# EasyEDA schematic FAN__Digital_Dimmer.json
TITLE: Sheet_1; REV: 1.0; Date: 2024-11-26; Sheet: 1/1; Drawn By: AmirB; Company: Your Company
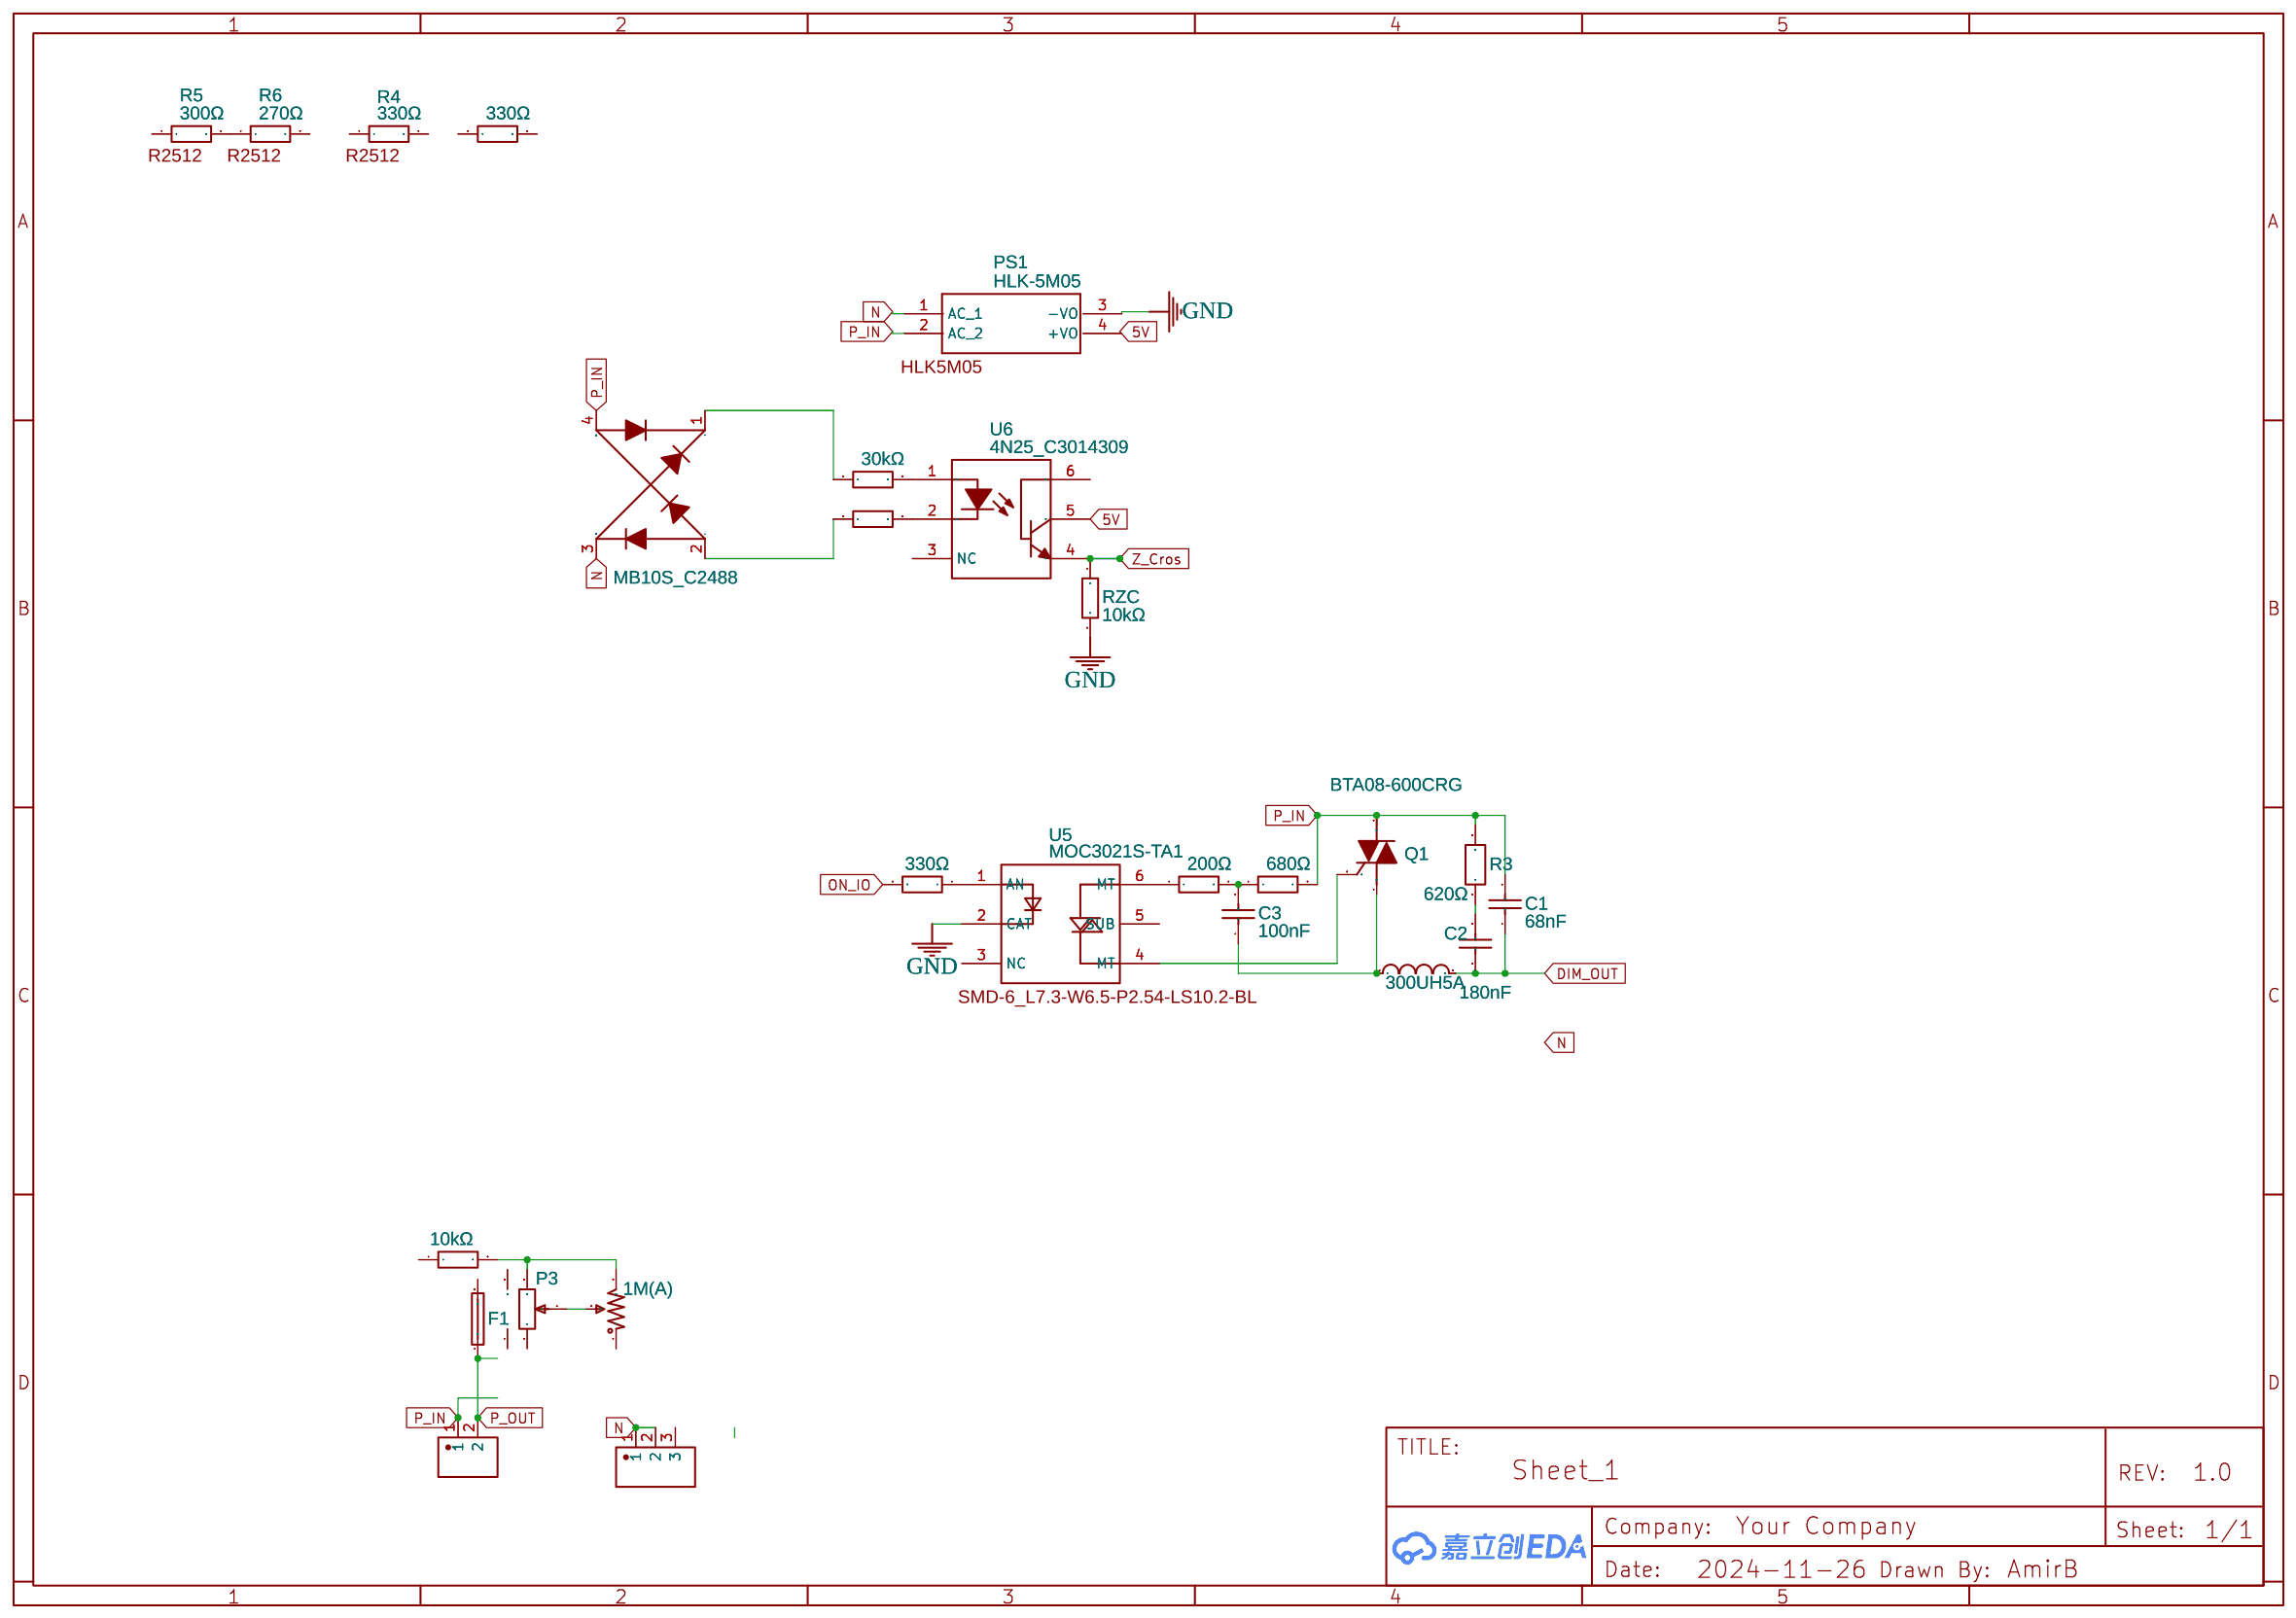
[diagram p0: schematic sheet]

## Parts
C1  68nF  [CAP-TH_L13.0-W6.0-P10.00-D1.2]
C2  180nF  [CAP-TH_L13.0-W6.0-P10.00-D1.2]
C3  100nF  [CAP-TH_L13.0-W6.0-P10.00-D0.6]
D1  MB10S_C2488  [MBS_L4.7-W3.8-P2.40-LS7.0-TL]
F1  0215002.MXEP  [FUSE-TH_BD5.5-L21.5-P25.50-D0.7]
P3  长柄旋转电位器  [RES-ADJ-TH_RV09]
P7  1M(A)  [RES-ADJ-TH_3P-L10.0-W10.0-P2.50-L]
PS1  HLK-5M05  [HLK5M05]
Q1  BTA08-600CRG  [TO-220-3_L10.0-W4.5-P2.54-L]
R1  30kΩ  [R2512]
R2  30kΩ  [R2512]
R3  620Ω  [R2512]
R4  330Ω  [R2512]
R5  300Ω  [R2512]
R6  270Ω  [R2512]
R7  330Ω  [R2512]
R8  200Ω  [R2512]
R9  680Ω  [R2512]
R14  330Ω  [R0603]
RL1V  10kΩ  [R0603]
RZC  10kΩ  [R0603]
U1  KF301R-5.0-3P  [CONN-TH_3P-P5.00_KF301R-5.0-3P]
U2  KF301-5.0-2P  [CONN-TH_P5.00_KF301-5.0-2P]
U3  300UH5A  [IND-TH_BD26.0-P10.80_300UH5A]
U5  MOC3021S-TA1  [SMD-6_L7.3-W6.5-P2.54-LS10.2-BL]
U6  4N25_C3014309  [DIP-6_L7.3-W6.5-P2.54-LS7.6-BL]

## Library data of the parts
C1 = MPP683J4130509LC: Supplier: LCSC; Manufacturer: SRD(圣融达); Supplier Part: C93252; JLCPCB Part Class: Extended Part; Package Display: No
C2 = MPP184J4130610LC: Supplier: LCSC; Manufacturer: SRD(圣融达); Supplier Part: C109611; JLCPCB Part Class: Extended Part; Package Display: No
C3 = MP2104KGC3RLC: Supplier: LCSC; Manufacturer: SRD(圣融达); Supplier Part: C93370; JLCPCB Part Class: Extended Part; Package Display: No
D1 = MB10S_C2488: Supplier: LCSC; Manufacturer: MDD(辰达半导体); Supplier Part: C2488; JLCPCB Part Class: Basic Part; Package Display: No
F1 = 0215002.MXEP: Contributor: LCSC; Supplier: LCSC; Supplier Part: C142787; Manufacturer: Littelfuse(美国力特); JLCPCB Part Class: Extended Part; Package Display: No
P3 = 长柄旋转电位器: Supplier: LCSC; Supplier Part: C2874842; Manufacturer: null; JLCPCB Part Class: Extended Part; Contributor: LCSC; Package Display: No
P7 = 3296W-1-103: Resistance(Ohms): 10K; Contributor: LCSC; JLCPCB Part Class: Extended Part; Package Display: No
PS1 = HLK-5M05: Contributor: rctutu; Package Display: Yes
Q1 = BTA08-600CRG: Supplier: LCSC; Manufacturer: ST(意法半导体); Supplier Part: C9102; JLCPCB Part Class: Extended Part; Package Display: No
R1 R2 = 25121WJ0303T4E: Supplier: LCSC; Manufacturer: UNI-ROYAL(厚声); Supplier Part: C25722; JLCPCB Part Class: Extended Part; Package Display: No
R3 = 25121WJ0621T4E: Contributor: LCSC; Supplier: LCSC; Supplier Part: C474165; Manufacturer: UNI-ROYAL(厚声); JLCPCB Part Class: Extended Part; Package Display: No
R4 = 25121WJ0331T4E: Supplier: LCSC; Manufacturer: UNI-ROYAL(厚声); Supplier Part: C19866; JLCPCB Part Class: Extended Part; Package Display: Yes
R5 = 25121WJ0301T4E: Supplier: LCSC; Manufacturer: UNI-ROYAL(厚声); Supplier Part: C25482; JLCPCB Part Class: Extended Part; Package Display: Yes
R6 = 25121WJ0271T4E: Supplier: LCSC; Manufacturer: UNI-ROYAL(厚声); Supplier Part: C25477; JLCPCB Part Class: Extended Part; Package Display: Yes
R7 = 25121WJ0331T4E: Supplier: LCSC; Manufacturer: UNI-ROYAL(厚声); Supplier Part: C19866; JLCPCB Part Class: Extended Part; Package Display: No
R8 = 25121WJ0201T4E: Supplier: LCSC; Manufacturer: UNI-ROYAL(厚声); Supplier Part: C25474; JLCPCB Part Class: Extended Part; Package Display: No
R9 = 25121WJ0681T4E: Contributor: LCSC; Supplier: LCSC; Supplier Part: C89584; Manufacturer: UNI-ROYAL(厚声); JLCPCB Part Class: Extended Part; Package Display: No
R14 = 0603WAF3300T5E: Supplier: LCSC; Manufacturer: UNI-ROYAL(厚声); Supplier Part: C23138; JLCPCB Part Class: Basic Part; Package Display: No
RL1V RZC = 0603WAF1002T5E: Supplier: LCSC; Manufacturer: UNI-ROYAL(厚声); Supplier Part: C25804; Resistance (Ohms): 10K; JLCPCB Part Class: Basic Part; Package Display: No
U1 = KF301R-5.0-3P: Contributor: LCSC; Supplier: LCSC; Supplier Part: C474884; Manufacturer: KEFA(科发); JLCPCB Part Class: Extended Part; Package Display: No
U2 = KF301-5.0-2P: Contributor: LCSC; Supplier: LCSC; Supplier Part: C474881; Manufacturer: KEFA(科发); JLCPCB Part Class: Extended Part; Package Display: No
U3 = 300UH5A: Contributor: LCSC; Supplier: LCSC; Supplier Part: C9900011335; Manufacturer: null; JLCPCB Part Class: Extended Part; Package Display: No
U5 = MOC3021S-TA1: Contributor: LCSC; Supplier: LCSC; Manufacturer: LITEON(光宝); Supplier Part: C115465; JLCPCB Part Class: Extended Part; Package Display: Yes
U6 = 4N25_C3014309: Contributor: lcsc; Supplier: LCSC; Supplier Part: C3014309; Manufacturer: UMW(友台半导体); JLCPCB Part Class: Extended Part; Package Display: No

## Nets
5V: U6.5
GND: PS1.3(-VO) RZC.2 U5.2(CAT)
DIM_OUT: C1.1 C2.1 U3.2
N: D1.3(C2) PS1.1(AC) U1.1 U1.2
ON_IO: R14.2
P_IN: C1.2 D1.4(C1) PS1.2(AC) Q1.2(M2) R3.2 R9.2 U2.1
P_OUT: F1.1 U2.2
Z_Cros: RZC.1 U6.4
Net-(C2-2): C2.2 R3.1
Net-(C3-1): C3.1 Q1.1(M1) U3.1
Net-(C3-2): C3.2 R8.2 R9.1
Net-(D1-1): D1.1(+) R1.1
Net-(D1-2): D1.2(-) R2.1
Net-(P3-2): P3.2 P7.2
Net-(P3-3): P3.3 P7.3 RL1V.2
Net-(Q1-3): Q1.3(G) U5.4(MT)
Net-(R1-2): R1.2 U6.1
Net-(R2-2): R2.2 U6.2
Net-(R5-2): R5.2 R6.1
Net-(R8-1): R8.1 U5.6(MT)
Net-(R14-1): R14.1 U5.1(AN)

Not connected (* = marked no-connect by the designer): F1 2; P3 1 4 5; P7 1; PS1 4(+VO); R4 1 2; R5 1; R6 2; R7 1 2; RL1V 1; U1 3; U5 3(NC) 5(SUB); U6 3(NC) 6
